# Altium schematic sheet 18_网口接口-2.schdoc
size 309 x 223 mm; Symbol: Sheet-Symbol_A4; Device: Sheet-Symbol_A4; Company: 嘉立创EDA; Version: V1.0; Page Size: A4; @Project Name: RK3568底板_V1.2; @Page Count: 6; @Update Date: 2024-05-10; @Create Date: 2024-04-18; @Schematic Name: 原理图; @Page No: 5; @Page Name: 网口接口
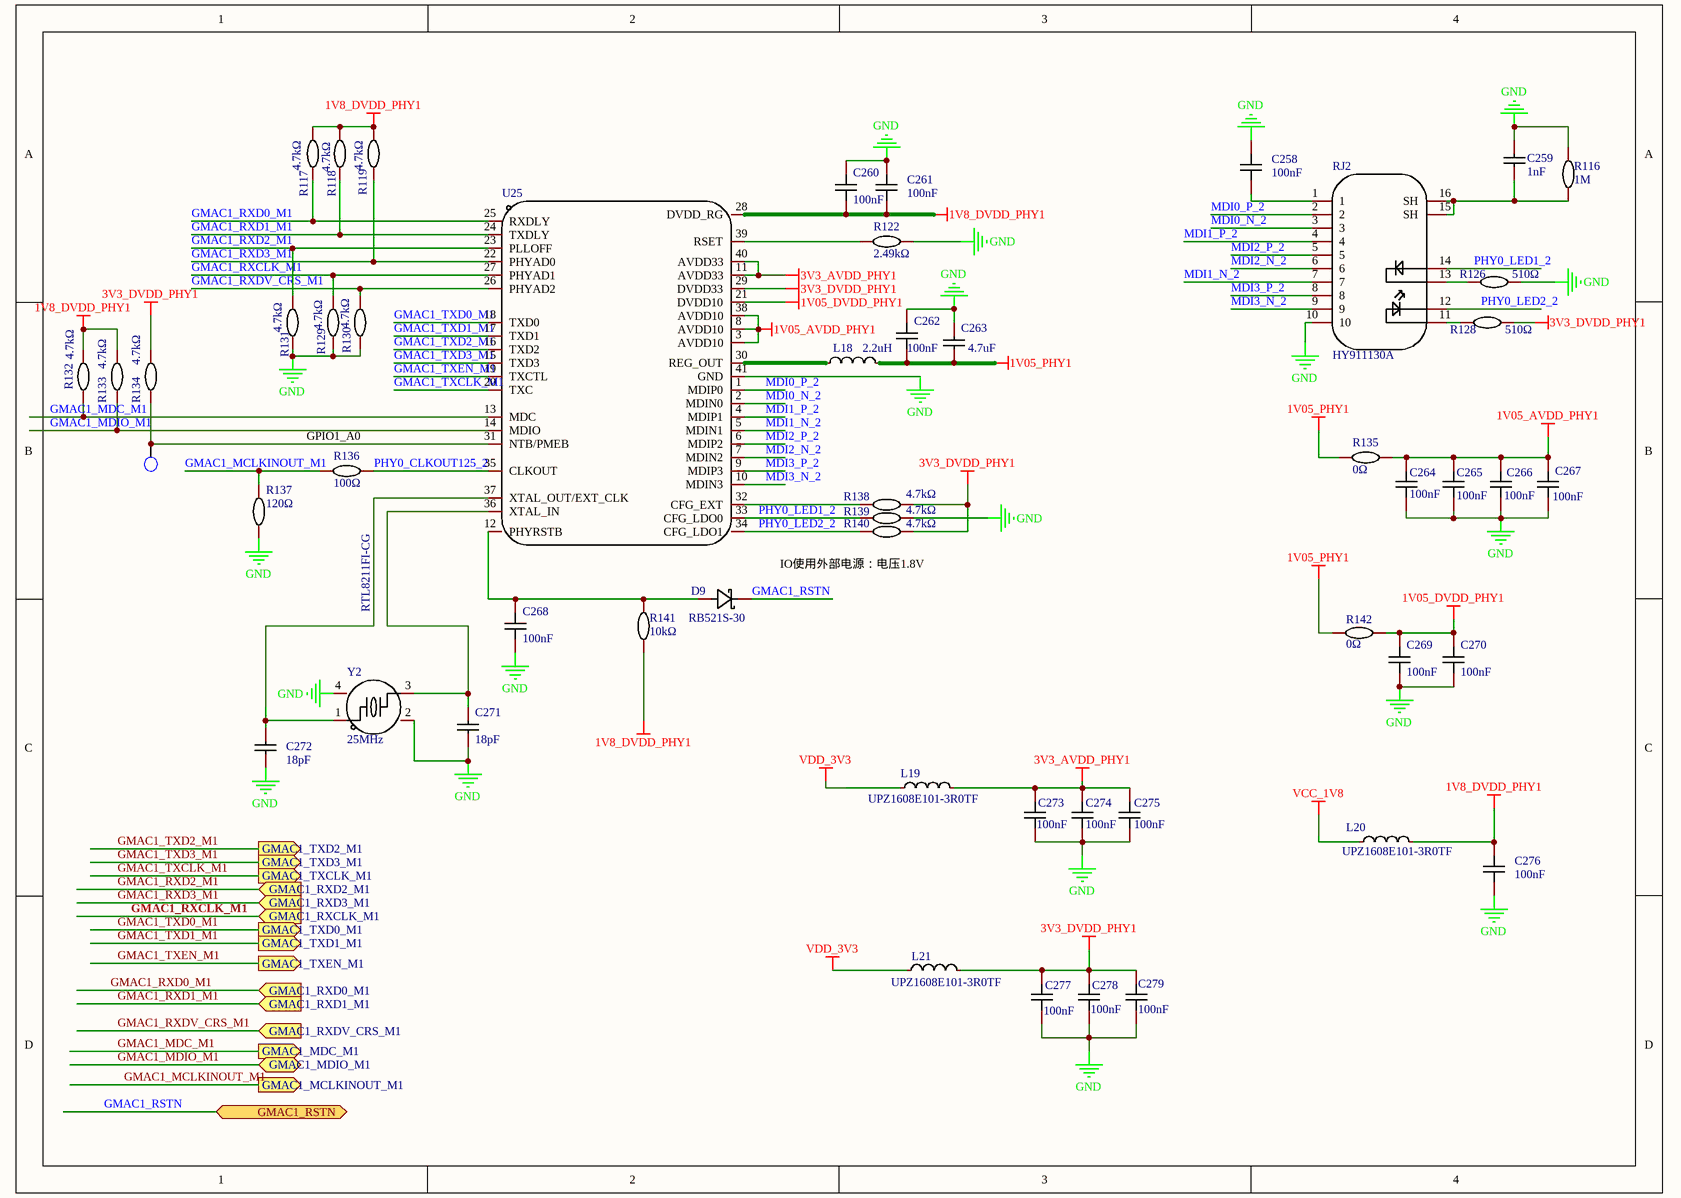
[diagram p0: 18_网口接口-2.schdoc]

## Parts
C258  100nF  [C0603]
C259  1nF  [C0603]
C260  100nF  [C0603]
C261  100nF  [C0603]
C262  100nF  [C0603]
C263  4.7uF  [C0603]
C264  100nF  [C0603]
C265  100nF  [C0603]
C266  100nF  [C0603]
C267  100nF  [C0603]
C268  100nF  [C0603]
C269  100nF  [C0603]
C270  100nF  [C0603]
C271  18pF  [C0603]
C272  18pF  [C0603]
C273  100nF  [C0603]
C274  100nF  [C0603]
C275  100nF  [C0603]
C276  100nF  [C0603]
C277  100nF  [C0603]
C278  100nF  [C0603]
C279  100nF  [C0603]
D9  RB521S-30  [SOD-523_L1.2-W0.8-LS1.6-RD]
L18  2.2uH  [IND-SMD_L2.5-W2.0-VLS252012CX-150M]
L19  UPZ1608E101-3R0TF  [L0603]
L20  UPZ1608E101-3R0TF  [L0603]
L21  UPZ1608E101-3R0TF  [L0603]
R116  1M  [R0805]
R117  4.7kΩ  [R0603]
R118  4.7kΩ  [R0603]
R119  4.7kΩ  [R0603]
R122  2.49kΩ  [R0603]
R126  510Ω  [R0603]
R128  510Ω  [R0603]
R129  4.7kΩ  [R0603]
R130  4.7kΩ  [R0603]
R131  4.7kΩ  [R0603]
R132  4.7kΩ  [R0603]
R133  4.7kΩ  [R0603]
R134  4.7kΩ  [R0603]
R135  0Ω  [R0603]
R136  100Ω  [R0603]
R137  120Ω  [R0603]
R138  4.7kΩ  [R0603]
R139  4.7kΩ  [R0603]
R140  4.7kΩ  [R0603]
R141  10kΩ  [R0603]
R142  0Ω  [R0603]
RJ2  HY911130A  [RJ45-TH_10P-P2.54-S2.54_L16.1-W21.4_HY911130A]
TP2  TP  [TP_0R70]  (value not drawn)
U25  RTL8211FI-CG  [QFN-40_L5.0-W5.0-P0.40-BL-EP3.7]
Y2  25MHz  [CRYSTAL-SMD_4P-L3.2-W2.5-BL]

## Ports
GMAC1_MCLKINOUT_M1 (out), GMAC1_MDC_M1 (out), GMAC1_MDIO_M1 (bidir), GMAC1_RSTN (bidir), GMAC1_RXCLK_M1 (in), GMAC1_RXD0_M1 (in), GMAC1_RXD1_M1 (in), GMAC1_RXD2_M1 (in), GMAC1_RXD3_M1 (in), GMAC1_RXDV_CRS_M1 (in), GMAC1_TXCLK_M1 (out), GMAC1_TXD0_M1 (out), GMAC1_TXD1_M1 (out), GMAC1_TXD2_M1 (out), GMAC1_TXD3_M1 (out), GMAC1_TXEN_M1 (out)

## Nets
1V05_AVDD_PHY1: C264.2 C265.2 C266.2 C267.2 R135.2 U25.3(AVDD10) U25.8(AVDD10) U25.38(AVDD10)
1V05_DVDD_PHY1: C269.2 C270.2 R142.1 U25.21(DVDD10)
1V05_PHY1: C262.1 C263.1 L18.2 R135.1 R142.2
1V8_DVDD_PHY1: C260.1 C261.1 C276.2 L20.1 R117.2 R118.2 R119.2 R132.2 R133.2 R141.2 U25.28(DVDD_RG)
3V3_AVDD_PHY1: C273.2 C274.2 C275.2 L19.1 U25.11(AVDD33) U25.40(AVDD33)
3V3_DVDD_PHY1: C277.2 C278.2 C279.2 L21.1 R128.2 R134.2 R138.2 R140.2 U25.29(DVDD33)
GND: C258.2 C259.1 C260.2 C261.2 C262.2 C263.2 C264.1 C265.1 C266.1 C267.1 C268.1 C269.1 C270.1 C271.2 C272.2 C273.1 C274.1 C275.1 C276.1 C277.1 C278.1 C279.1 R116.1 R122.2 R126.2 R129.1 R130.1 R131.1 R137.1 R139.2 RJ2.10 U25.41(GND) Y2.2(GND) Y2.4(GND)
VCC_1V8: L20.2
VDD_3V3: L19.2 L21.2
GMAC1_MCLKINOUT_M1: R136.1 R137.2 ; port GMAC1_MCLKINOUT_M1
GMAC1_MDC_M1: R132.1 U25.13(MDC) ; port GMAC1_MDC_M1
GMAC1_MDIO_M1: R133.1 U25.14(MDIO) ; port GMAC1_MDIO_M1
GMAC1_RSTN: D9.1(K) ; port GMAC1_RSTN
GMAC1_RXCLK_M1: R129.2 U25.27(PHYAD1) ; port GMAC1_RXCLK_M1
GMAC1_RXD0_M1: R117.1 U25.25(RXDLY) ; port GMAC1_RXD0_M1
GMAC1_RXD1_M1: R118.1 U25.24(TXDLY) ; port GMAC1_RXD1_M1
GMAC1_RXD2_M1: R131.2 U25.23(PLLOFF) ; port GMAC1_RXD2_M1
GMAC1_RXD3_M1: R119.1 U25.22(PHYAD0) ; port GMAC1_RXD3_M1
GMAC1_RXDV_CRS_M1: R130.2 U25.26(PHYAD2) ; port GMAC1_RXDV_CRS_M1
GMAC1_TXCLK_M1: U25.20(TXC) ; port GMAC1_TXCLK_M1
GMAC1_TXD0_M1: U25.18(TXD0) ; port GMAC1_TXD0_M1
GMAC1_TXD1_M1: U25.17(TXD1) ; port GMAC1_TXD1_M1
GMAC1_TXD2_M1: U25.16(TXD2) ; port GMAC1_TXD2_M1
GMAC1_TXD3_M1: U25.15(TXD3) ; port GMAC1_TXD3_M1
GMAC1_TXEN_M1: U25.19(TXCTL) ; port GMAC1_TXEN_M1
MDI0_N_2: RJ2.3 U25.2(MDIN0)
MDI0_P_2: RJ2.2 U25.1(MDIP0)
MDI1_N_2: RJ2.7 U25.5(MDIN1)
MDI1_P_2: RJ2.4 U25.4(MDIP1)
MDI2_N_2: RJ2.6 U25.7(MDIN2)
MDI2_P_2: RJ2.5 U25.6(MDIP2)
MDI3_N_2: RJ2.9 U25.10(MDIN3)
MDI3_P_2: RJ2.8 U25.9(MDIP3)
PHY0_CLKOUT125_2: R136.2 U25.35(CLKOUT)
PHY0_LED1_2: R139.1 RJ2.14 U25.33(CFG_LDO0)
PHY0_LED2_2: R140.1 RJ2.12 U25.34(CFG_LDO1)
NetC258_1: C258.1 RJ2.1
NetC259_2: C259.2 R116.2 RJ2.15(SH) RJ2.16(SH)
NetC268_2: C268.2 D9.2(A) R141.1 U25.12(PHYRSTB)
NetC271_1: C271.1 U25.36(XTAL_IN) Y2.3
NetC272_1: C272.1 U25.37(XTAL_OUT/EXT_CLK) Y2.1
NetL18_1: L18.1 U25.30(REG_OUT)
NetR122_1: R122.1 U25.39(RSET)
NetR126_1: R126.1 RJ2.13
NetR128_1: R128.1 RJ2.11
NetR134_1: R134.1 TP2.1 U25.31(NTB/PMEB)
NetR138_1: R138.1 U25.32(CFG_EXT)

## Notes on the sheet
- (near R136) GPIO1_A0
- IO使用外部电源：电压1.8V
- 1
- 2
- 3
- 4
- 5
- 6
- A
- B
- C
- 原理图
- 创建日期
- 更新日期
- 2024-05-10
- 2024-04-18
- 审阅
- 绘制
- 图页
- 网口接口
- 物料编码
- RK3568底板_V1.2
- D
- 版本
- 尺寸
- 页
- 共
- V1.0
- A4
- 嘉立创EDA

## Library data of the parts
C258 C260-C262 C264-C270 C273-C279 = CC0603KRX7R9BB104: Manufacturer: YAGEO(国巨); Add into BOM: yes; Tolerance: ±10%; Voltage Rated: 50V; Temperature Coefficient: X7R; Name: 100nF; Symbol: CC0603KRX7R9BB104; Device: CC0603KRX7R9BB104; Supplier: LCSC; Manufacturer Part: CC0603KRX7R9BB104; Value: 100nF; Supplier Part: C14663; JLCPCB Part Class: 基础库; LCSC Part Name: 100nF ±10% 50V; Supplier Footprint: 0603; Datasheet: https://atta.szlcsc.com/upload/public/pdf/source/20180910/C282072_33301C7F631E79921B82A8DAC6BCC5B3.pdf; Convert to PCB: yes
C259 = CC0603KRX7R9BB102: Manufacturer: YAGEO(国巨); Add into BOM: yes; Tolerance: ±10%; Voltage Rated: 50V; Temperature Coefficient: X7R; Name: 1nF; Symbol: CC0603KRX7R9BB102; Device: CC0603KRX7R9BB102; Supplier: LCSC; Manufacturer Part: CC0603KRX7R9BB102; Value: 1nF; Supplier Part: C100040; JLCPCB Part Class: 扩展库; LCSC Part Name: 1nF ±10% 50V; Supplier Footprint: 0603; Datasheet: https://atta.szlcsc.com/upload/public/pdf/source/20180910/C282072_33301C7F631E79921B82A8DAC6BCC5B3.pdf; Convert to PCB: yes
C263 = CL10A475KO8NNNC: Manufacturer: SAMSUNG(三星); Add into BOM: yes; Tolerance: ±10%; Voltage Rated: 16V; Temperature Coefficient: X5R; Name: 4.7uF; Symbol: CL10A475KO8NNNC; Device: CL10A475KO8NNNC; Supplier: LCSC; Manufacturer Part: CL10A475KO8NNNC; Value: 4.7uF; Supplier Part: C19666; JLCPCB Part Class: 基础库; LCSC Part Name: 4.7uF ±10% 16V; Supplier Footprint: 0603; Datasheet: https://atta.szlcsc.com/upload/public/pdf/source/20160218/1457707763339.pdf; Convert to PCB: yes
C271 C272 = CL10C180JB8NNNC: Manufacturer: SAMSUNG(三星); Add into BOM: yes; Tolerance: ±5%; Voltage Rated: 50V; Temperature Coefficient: C0G; Name: 18pF; Symbol: CL10C180JB8NNNC; Device: CL10C180JB8NNNC; LCSC Part Name: 18pF ±5% 50V; Supplier Part: C1647; Manufacturer Part: CL10C180JB8NNNC; Supplier Footprint: 0603; JLCPCB Part Class: 基础库; Datasheet: https://atta.szlcsc.com/upload/public/pdf/source/20160218/1457707763339.pdf; Supplier: LCSC; Convert to PCB: yes; Value: 18pF
D9 = RB521S-30_C727120: Manufacturer: TWGMC(台湾迪嘉); Add into BOM: yes; Diode Configuration: 独立式; Forward Voltage (Vf@If): 500mV@200mA; Reverse Voltage (Vr): 30V; Average Rectified Current (Io): 200mA; Reverse Leakage Current (Ir): 30uA@10V; Name: RB521S-30; Symbol: RB521S-30_C727120; Device: RB521S-30_C727120; Supplier: LCSC; Supplier Part: C727120; Manufacturer Part: RB521S-30; JLCPCB Part Class: 扩展库; LCSC Part Name: 电压:30V 电流:200mA; Supplier Footprint: SOD-523; Datasheet: https://atta.szlcsc.com/upload/public/pdf/source/20200828/C727120_3E9BC491271A3437FD0D1FDCF4FF716C.pdf; Convert to PCB: yes
L18 = FXLB252012-2R2-M: Manufacturer: cjiang(长江微电); Add into BOM: yes; Tolerance: ±20%; Rated Current: 3A; Saturation Current (Isat): 3.3A; DC Resistance (DCR): 68mΩ; Type: 一体成型电感; Name: 2.2uH; Symbol: FXLB252012-2R2-M; Device: FXLB252012-2R2-M; LCSC Part Name: 2.2uH ±20% 3.3A; Supplier Part: C3040393; Manufacturer Part: FXLB252012-2R2-M; Supplier Footprint: SMD,2.5x2.0x1.2mm; JLCPCB Part Class: 扩展库; Datasheet: https://atta.szlcsc.com/upload/public/pdf/source/20220812/975CD70F8F8BB72DF45FA36D37878048.pdf; Supplier: LCSC; Convert to PCB: yes; Value: 2.2uH; Ratings: AEC-Q200
L19-L21 = UPZ1608E101-3R0TF: Manufacturer: Sunlord(顺络); Add into BOM: yes; Impedance @ Frequency: 100Ω@100MHz; Tolerance: ±25%; DC Resistance: 30mΩ; Current Rating: 3A; Circuits: 1; Name: UPZ1608E101-3R0TF; Symbol: UPZ1608E101-3R0TF; Device: UPZ1608E101-3R0TF; LCSC Part Name: 单路 0603磁珠 阻抗100Ω@100MHz; Supplier Part: C96995; Manufacturer Part: UPZ1608E101-3R0TF; Supplier Footprint: 0603; JLCPCB Part Class: 扩展库; Datasheet: https://atta.szlcsc.com/upload/public/pdf/source/20231030/6F67BDFA94A48EA93F9ABB358D1D978C.pdf; Supplier: LCSC; Convert to PCB: yes
R116 = Res_0805: Symbol: 电阻; Convert to PCB: yes; Name: 1M; Device: Res_0805; Add into BOM: yes; Supplier Footprint: 0805; Value: 1M
R117-R119 R129-R134 R138-R140 = 0603WAF4701T5E: Manufacturer: UNI-ROYAL(厚声); Add into BOM: yes; Tolerance: ±1%; Power(Watts): 100mW; Overload Voltage (Max): 75V; Temperature Coefficient: ±100ppm/℃; Name: 4.7kΩ; Symbol: 0603WAF4701T5E; Device: 0603WAF4701T5E; Supplier: LCSC; Manufacturer Part: 0603WAF4701T5E; Supplier Part: C23162; Value: 4.7kΩ; JLCPCB Part Class: 基础库; LCSC Part Name: 4.7kΩ ±1% 100mW 厚膜电阻; Supplier Footprint: 0603; Datasheet: https://atta.szlcsc.com/upload/public/pdf/source/20200306/C422600_1E6D84923E4A46A82E41ADD87F860B5C.pdf; Convert to PCB: yes; Type: 厚膜电阻; Operating Temperature Range: -55℃~+155℃
R122 = 0603WAF2491T5E: Manufacturer: UNI-ROYAL(厚声); Add into BOM: yes; Tolerance: ±1%; Power(Watts): 100mW; Overload Voltage (Max): 75V; Temperature Coefficient: ±100ppm/℃; Name: 2.49kΩ; Symbol: 0603WAF2491T5E; Device: 0603WAF2491T5E; Supplier: LCSC; Manufacturer Part: 0603WAF2491T5E; Supplier Part: C22908; Value: 2.49kΩ; JLCPCB Part Class: 扩展库; LCSC Part Name: 2.49kΩ ±1% 100mW 厚膜电阻; Supplier Footprint: 0603; Datasheet: https://atta.szlcsc.com/upload/public/pdf/source/20200306/C422600_1E6D84923E4A46A82E41ADD87F860B5C.pdf; Convert to PCB: yes; Type: 厚膜电阻; Operating Temperature Range: -55℃~+155℃
R126 R128 = 0603WAF5100T5E: Manufacturer: UNI-ROYAL(厚声); Add into BOM: yes; Tolerance: ±1%; Power(Watts): 100mW; Overload Voltage (Max): 75V; Temperature Coefficient: ±100ppm/℃; Name: 510Ω; Symbol: 0603WAF5100T5E; Device: 0603WAF5100T5E; Supplier: LCSC; Manufacturer Part: 0603WAF5100T5E; Supplier Part: C23193; Value: 510Ω; JLCPCB Part Class: 基础库; LCSC Part Name: 510Ω ±1% 100mW 厚膜电阻; Supplier Footprint: 0603; Datasheet: https://atta.szlcsc.com/upload/public/pdf/source/20200306/C422600_1E6D84923E4A46A82E41ADD87F860B5C.pdf; Convert to PCB: yes; Type: 厚膜电阻; Operating Temperature Range: -55℃~+155℃
R135 R142 = 0603WAF0000T5E: Manufacturer: UNI-ROYAL(厚声); Add into BOM: yes; Tolerance: ±1%; Power(Watts): 100mW; Overload Voltage (Max): 75V; Name: 0Ω; Symbol: 0603WAF0000T5E; Device: 0603WAF0000T5E; Supplier: LCSC; Manufacturer Part: 0603WAF0000T5E; Supplier Part: C21189; Value: 0Ω; JLCPCB Part Class: 基础库; LCSC Part Name: 0Ω ±1% 100mW 厚膜电阻; Supplier Footprint: 0603; Datasheet: https://atta.szlcsc.com/upload/public/pdf/source/20200306/C422600_1E6D84923E4A46A82E41ADD87F860B5C.pdf; Convert to PCB: yes; Type: 厚膜电阻; Operating Temperature Range: -55℃~+155℃
R136 = 0603WAF1000T5E: Manufacturer: UNI-ROYAL(厚声); Add into BOM: yes; Tolerance: ±1%; Power(Watts): 100mW; Overload Voltage (Max): 75V; Temperature Coefficient: ±200ppm/℃; Name: 100Ω; Symbol: 0603WAF1000T5E; Device: 0603WAF1000T5E; LCSC Part Name: 100Ω ±1% 100mW 厚膜电阻; Supplier Part: C22775; Manufacturer Part: 0603WAF1000T5E; Supplier Footprint: 0603; JLCPCB Part Class: 基础库; Datasheet: https://atta.szlcsc.com/upload/public/pdf/source/20200306/C422600_1E6D84923E4A46A82E41ADD87F860B5C.pdf; Supplier: LCSC; Convert to PCB: yes; Type: 厚膜电阻; Value: 100Ω; Operating Temperature Range: -55℃~+155℃
R137 = 0603WAF1200T5E: Manufacturer: UNI-ROYAL(厚声); Add into BOM: yes; Tolerance: ±1%; Power(Watts): 100mW; Overload Voltage (Max): 75V; Temperature Coefficient: ±100ppm/℃; Name: 120Ω; Symbol: 0603WAF1200T5E; Device: 0603WAF1200T5E; Supplier: LCSC; Manufacturer Part: 0603WAF1200T5E; Supplier Part: C22787; Value: 120Ω; JLCPCB Part Class: 基础库; LCSC Part Name: 120Ω ±1% 100mW 厚膜电阻; Supplier Footprint: 0603; Datasheet: https://atta.szlcsc.com/upload/public/pdf/source/20200306/C422600_1E6D84923E4A46A82E41ADD87F860B5C.pdf; Convert to PCB: yes; Type: 厚膜电阻; Operating Temperature Range: -55℃~+155℃
R141 = 0603WAF1002T5E: Manufacturer: UNI-ROYAL(厚声); Add into BOM: yes; Tolerance: ±1%; Power(Watts): 100mW; Overload Voltage (Max): 75V; Temperature Coefficient: ±100ppm/℃; Name: 10kΩ; Symbol: 0603WAF1002T5E; Device: 0603WAF1002T5E; Supplier: LCSC; Manufacturer Part: 0603WAF1002T5E; Supplier Part: C25804; Value: 10kΩ; JLCPCB Part Class: 基础库; LCSC Part Name: 厚膜电阻 10kΩ ±1% 100mW; Supplier Footprint: 0603; Datasheet: https://atta.szlcsc.com/upload/public/pdf/source/20200306/C422600_1E6D84923E4A46A82E41ADD87F860B5C.pdf; Convert to PCB: yes; Type: 厚膜电阻; Operating Temperature Range: -55℃~+155℃
RJ2 = HY911130A: Manufacturer: HANRUN(汉仁); Add into BOM: yes; Connector Type: RJ插座; USOC Codes: RJ45; Number of Ports: 1; Shielding: 有屏蔽; LED: 带LED; Name: HY911130A; Symbol: HY911130A; Device: HY911130A; Supplier: LCSC; Manufacturer Part: HY911130A; Supplier Part: C55679; JLCPCB Part Class: 扩展库; LCSC Part Name: RJ45 带LED; Supplier Footprint: 插件; Datasheet: https://atta.szlcsc.com/upload/public/pdf/source/20151014/1457707458663.pdf; Convert to PCB: yes; Ratings: -
U25 = RTL8211FI-CG: Manufacturer: REALTEK(瑞昱); Add into BOM: yes; Name: RTL8211FI-CG; Symbol: RTL8211FI-CG; Device: RTL8211FI-CG; LCSC Part Name: 集成10/100/1000M以太网精密收发器; Supplier Part: C717681; Manufacturer Part: RTL8211FI-CG; Supplier Footprint: QFN-40-EP(5x5); JLCPCB Part Class: 扩展库; Datasheet: https://atta.szlcsc.com/upload/public/pdf/source/20230811/F5B2BED88AB5EA25EC708468CC105183.pdf; Supplier: LCSC; Convert to PCB: yes
Y2 = XL2EL89CSI-111YLC-25M: Manufacturer: YXC(扬兴晶振); Add into BOM: yes; Crystal Type: 贴片晶振; Normal temperature Frequency Tolerance: ±10ppm; External load capacitor: 20pF; Name: 25MHz; Symbol: XL2EL89CSI-111YLC-25M; Device: XL2EL89CSI-111YLC-25M; Supplier: LCSC; Supplier Part: C5280577; Manufacturer Part: XL2EL89CSI-111YLC-25M; Value: 25MHz; JLCPCB Part Class: 扩展库; LCSC Part Name: 25MHz ±10ppm 20pF YSX321SL; Supplier Footprint: SMD3225-4P; Datasheet: https://atta.szlcsc.com/upload/public/pdf/source/20221123/8DAA01809C4E3F159850A71277C18D74.pdf; Convert to PCB: yes